# EAGLE design Argos_Battery_Charge_Monitor_Sensor (EAGLE 8.4.2)
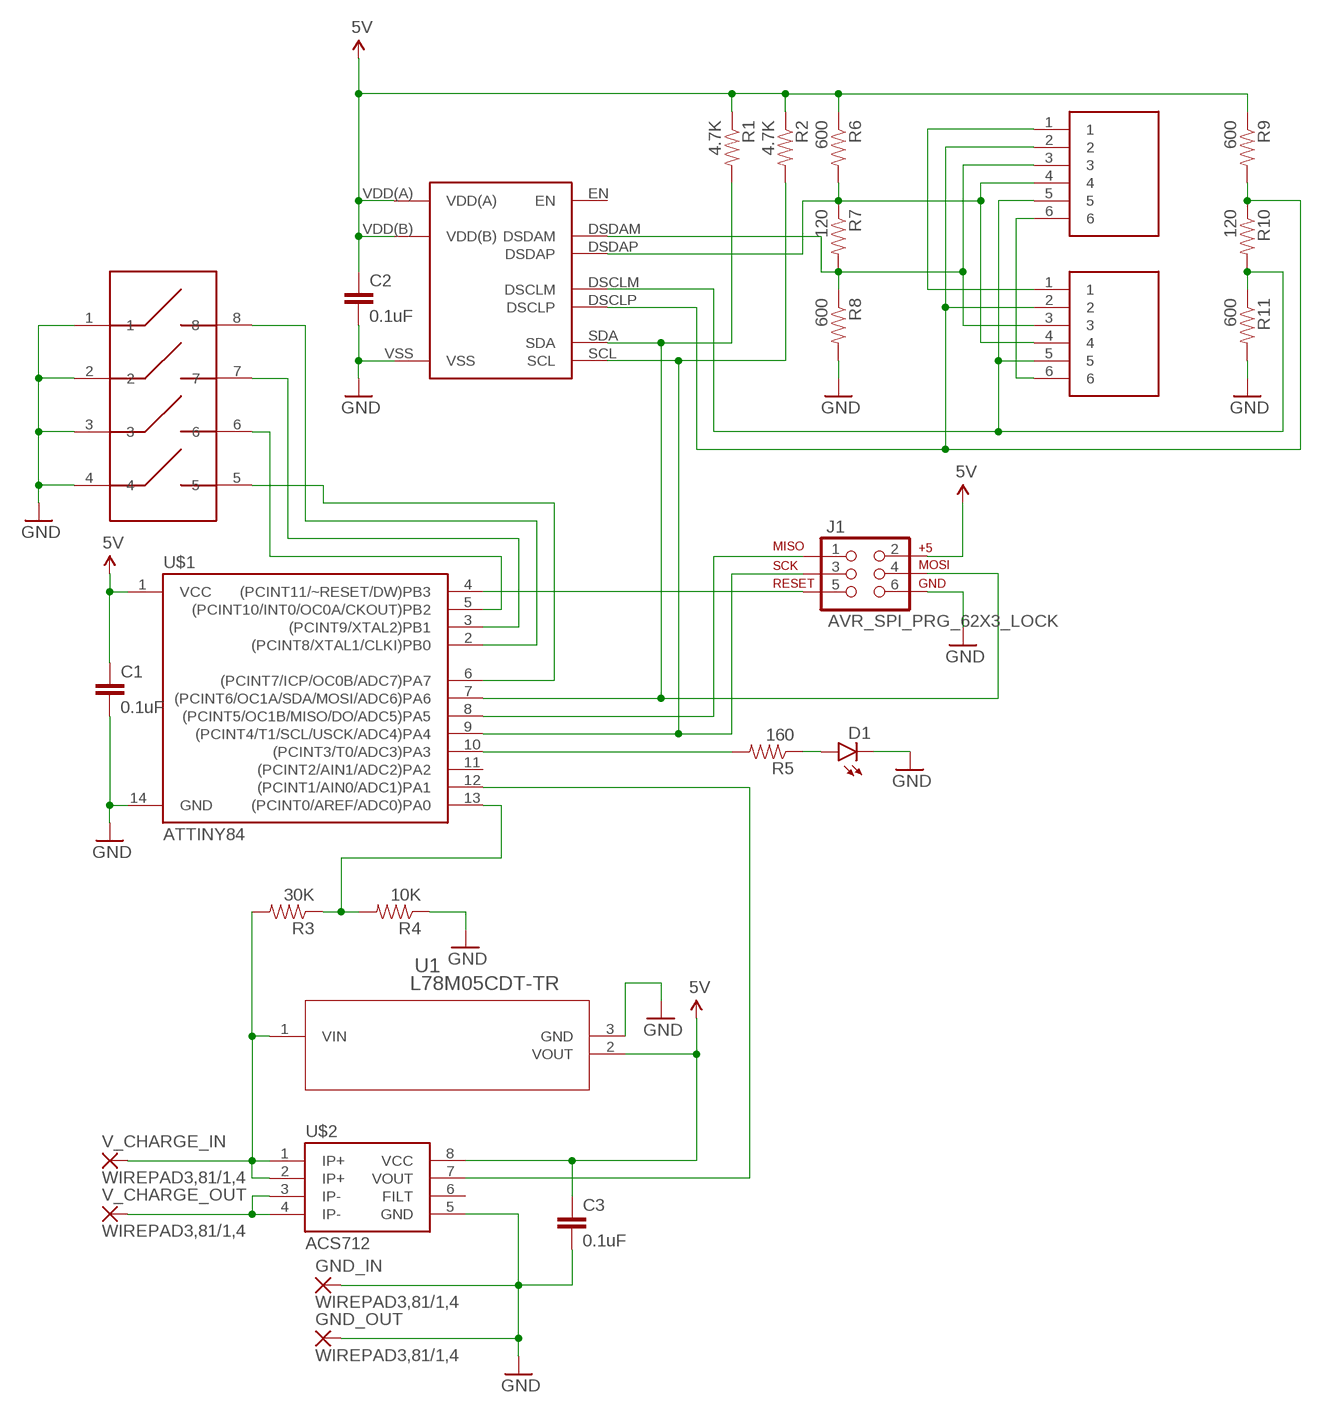
[diagram p0: schematic, sheet 1]

## Parts
C1  0.1uF  CAP0805  [0805]
C2  0.1uF  CAP0805  [0805]
C3  0.1uF  CAP0805  [0805]
D1  LED3MM  [LED3MM]
GND_IN  WIREPAD3,81/1,4  [3,81/1,4]
GND_OUT  WIREPAD3,81/1,4  [3,81/1,4]
J1  AVR_SPI_PRG_62X3_LOCK  [2X3_LOCK]
R1  4.7K  RESISTOR0805-RES  [0805]
R2  4.7K  RESISTOR0805-RES  [0805]
R3  30K  RESISTOR0805-RES  [0805]
R4  10K  RESISTOR0805-RES  [0805]
R5  160  RESISTOR0805-RES  [0805]
R6  600  RESISTOR0805-RES  [0805]
R7  120  RESISTOR0805-RES  [0805]
R8  600  RESISTOR0805-RES  [0805]
R9  600  RESISTOR0805-RES  [0805]
R10  120  RESISTOR0805-RES  [0805]
R11  600  RESISTOR0805-RES  [0805]
U1  L78M05CDT-TR  [DPAK]
U$1  ATTINY84  [SO14]
U$2  ACS712  [SO08]
U$3  SOP50P490X110-10N  [SOP50P490X110-10N]
U$4  E5566-Q0LK22-L  [E5566-Q0LK22-L]
U$5  E5566-Q0LK22-L  [E5566-Q0LK22-L]
U$6  210-4MS  [210-4MS]
V_CHARGE_IN  WIREPAD3,81/1,4  [3,81/1,4]
V_CHARGE_OUT  WIREPAD3,81/1,4  [3,81/1,4]

## Nets
5V: C1.1 C2.1 C3.1 J1.2 R1.1 R2.1 R6.1 R9.1 U1.2(VOUT) U$1.1(VCC) U$2.8(VCC) U$3.VDD(A) U$3.VDD(B)
D_SCK_M: R10.2 R11.1 U$3.DSCLM U$4.5 U$5.5
D_SCK_P: R9.2 R10.1 U$3.DSCLP U$4.2 U$5.2
D_SDA_M: R7.2 R8.1 U$3.DSDAM U$4.3 U$5.3
D_SDA_P: R6.2 R7.1 U$3.DSDAP U$4.4 U$5.4
GND: C1.2 C2.2 C3.2 D1.K(C) GND_IN.1(P) GND_OUT.1(P) J1.6 R4.1 R8.2 R11.2 U1.3(GND) U$1.14(GND) U$2.5(GND) U$3.VSS U$6.1 U$6.2 U$6.3 U$6.4
N$1: U$4.1 U$5.1
N$2: U$1.5((PCINT10/INT0/OC0A/CKOUT)PB2) U$6.6
N$3: U$1.3((PCINT9/XTAL2)PB1) U$6.7
N$4: U$1.2((PCINT8/XTAL1/CLKI)PB0) U$6.8
N$5: U$1.6((PCINT7/ICP/OC0B/ADC7)PA7) U$6.5
N$6: U$4.6 U$5.6
N$7 [POWER]: R3.2 U1.1(VIN) U$2.1(IP+) U$2.2(IP+) V_CHARGE_IN.1(P)
N$8: R3.1 R4.2 U$1.13((PCINT0/AREF/ADC0)PA0)
N$9 [POWER]: U$2.3(IP-) U$2.4(IP-) V_CHARGE_OUT.1(P)
N$11: U$1.12((PCINT1/AIN0/ADC1)PA1) U$2.7(VOUT)
N$12: D1.A R5.1
N$13: J1.5 U$1.4((PCINT11/~RESET/DW)PB3)
N$15: J1.1 U$1.8((PCINT5/OC1B/MISO/DO/ADC5)PA5)
N$16: R5.2 U$1.10((PCINT3/T0/ADC3)PA3)
SCL: J1.3 R2.2 U$1.9((PCINT4/T1/SCL/USCK/ADC4)PA4) U$3.SCL
SDA: J1.4 R1.2 U$1.7((PCINT6/OC1A/SDA/MOSI/ADC6)PA6) U$3.SDA
Unconnected: U$1.11((PCINT2/AIN1/ADC2)PA2) U$2.6(FILT) U$3.EN

## Library data of the parts
C1-C3 = SparkFun-Capacitors:CAP: Capacitor Standard 0603 ceramic capacitor, and 0.1" leaded capacitor.
D1 = SparkFun-LED:LED: LEDs Standard schematic elements and footprints for 5mm, 3mm, 1206, and 0603 sized LEDs. 5mm - Spark Fun Electronics SKU : COM-00529 (and others); PROD_ID: DIO-08794
GND_IN GND_OUT V_CHARGE_IN V_CHARGE_OUT = wirepad:WIREPAD: Wire PAD connect wire on PCB
J1 = SparkFun-Connectors:AVR_SPI_PRG_6: AVR ISP 6 Pin This is the reduced ISP connector for AVR programming. Common on Arduino. This footprint will take up less PCB space and can be used with a 10-pin to 6-pin adapter such as SKU: BOB-08508 **Special note about "TEST_POINT" package. The stop mask is on the top side, so if you want your programming test points to be on the bottom of your board, make sure to place this package on the bottom side of the board. This also ensure that the orientation to program from the bottom side will be correct.
R1-R11 = SparkFun-Passives:RESISTOR: Resistor Basic schematic elements and footprints for 0603, 1206, and PTH resistors.
U1 = Digikey:L78M05CDT-TR; MANUFACTURER_PART_NUMBER: L78M05CDTTR; VENDOR: ST Microelectronics
U$1 = SparkFun-DigitalIC:ATTINY84: Atmel 14-pin 2/4/8kB flash uC; PROD_ID: IC-11285
U$2 = SparkFun-AnalogIC:ACS712: Hall-effect-based isolated linear current sensor; PROD_ID: IC-08964
U$3 = SOP50P490X110-10N:SOP50P490X110-10N
U$4 U$5 = E5566-Q0LK22-L:E5566-Q0LK22-L
U$6 = 210-4MS:210-4MS

## Net classes
0 default: width 0.152 mm, clearance 0.152 mm
1 POWER: width 3.607 mm, clearance 0.152 mm

## Board
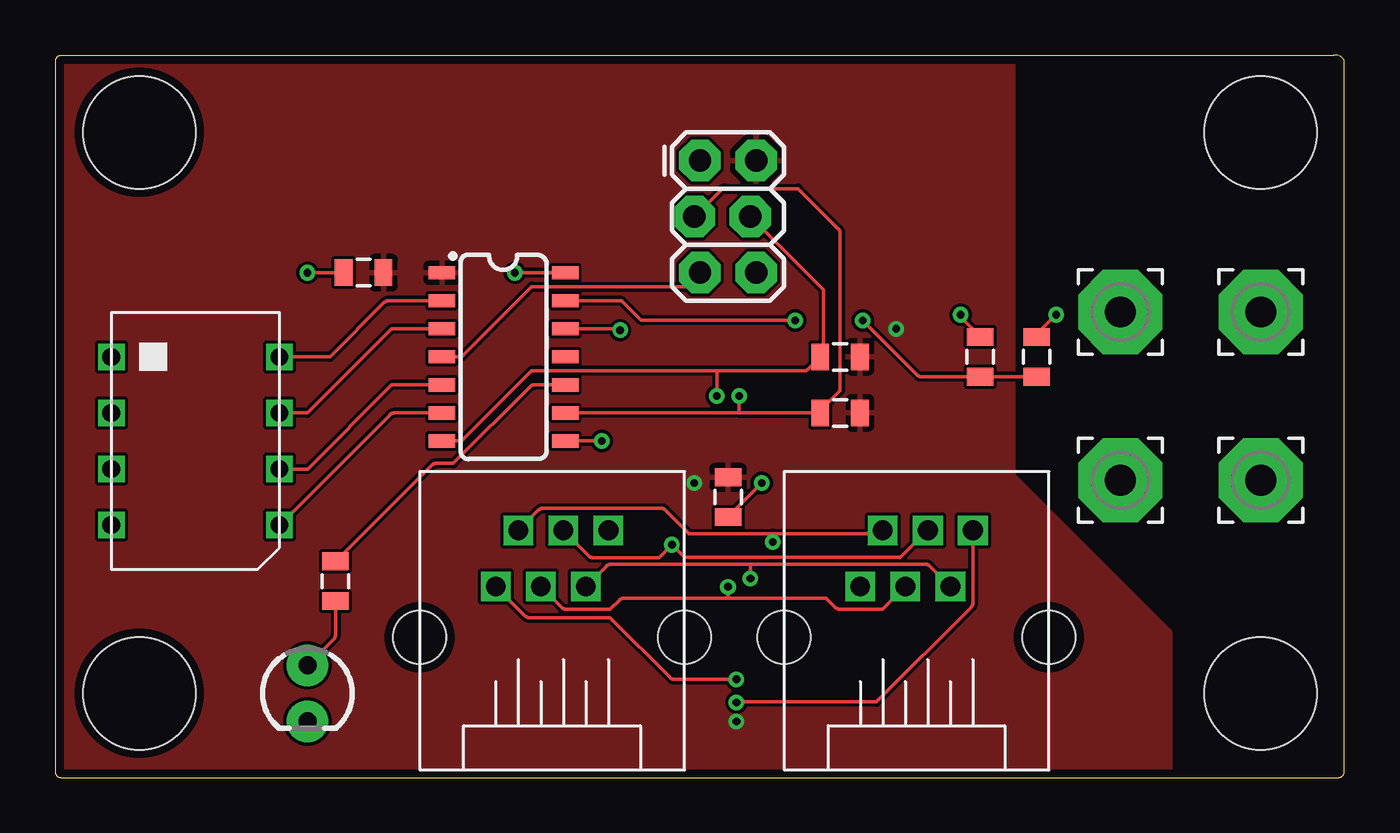
[diagram p1: board, top side]
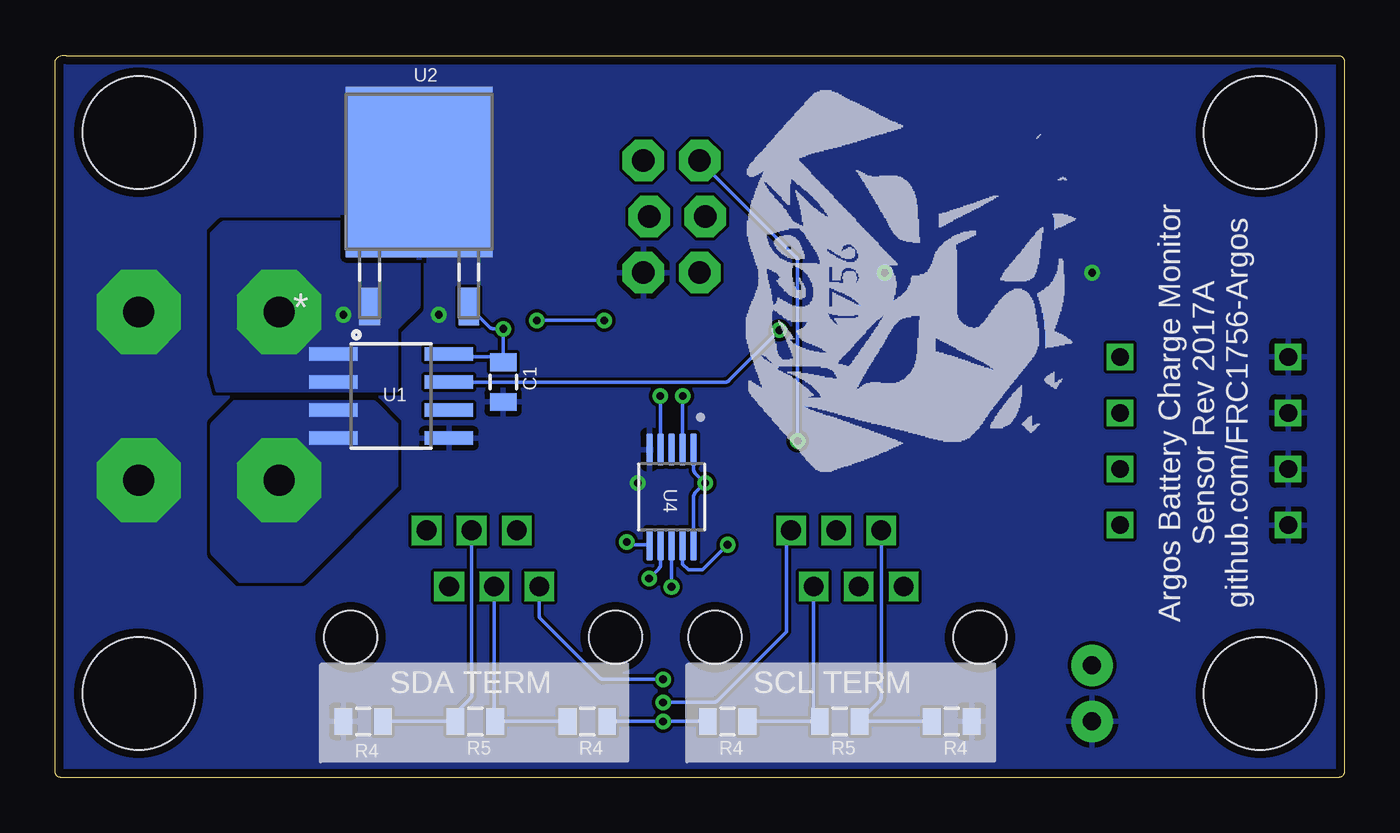
[diagram p2: board, bottom side, seen from below]

Size 58.4 x 32.71 mm. Coordinates in mm from the lower left corner, seen from the top.
Outline: 0,32.44 0,0.25 arc90 0.25,0 58.15,0 arc90 58.4,0.25 58.4,32.44 arc90 57.89,32.69 0.25,32.69 arc90 0,32.44
Copper layers (1*16): Top 0.0356mm / dielectric 1.5011mm / Bottom 0.0356mm
Design rules "LaenPCBOrder": minimum track width 6mil, minimum drill 13mil, track to track 6mil, track to pad 6mil, pad to pad 6mil, via to via 6mil, smd to smd 6mil, copper to edge 15mil, drill to drill 6mil, minimum pad ring 7mil, minimum via ring 7mil, stop-mask expansion 3mil, vias tented up to drill 0mil, thermal gap 10mil
Holes 5.08 mm at 3.81,3.81 54.61,3.81 3.81,29.21 54.61,29.21

### Footprints (pad centres in the part's own frame; a part is rotated, then mirrored left to right if it is on the bottom)
0805 = smd 0.8 x 1.2: 1 -0.9,0; 2 0.9,0
LED3MM = drill 0.813 pad 1.88: A -1.27,0; K 1.27,0
3,81/1,4 = drill 1.397 pad 3.81 octagon: 1 0,0
2X3_LOCK = drill 1.016 pad 1.88 octagon: 1 0,0; 2 0,2.54; 3 2.54,-0.254; 4 2.54,2.286; 5 5.08,0; 6 5.08,2.54
DPAK = smd 0.94 x 1.702: 1 -2.25,-6.109; 2 2.25,-6.109 | smd 6.655 x 7.722: 3 0,0
SO14 = smd 0.6 x 1.2: 1 -3.81,-2.8; 2 -2.54,-2.8; 3 -1.27,-2.8; 4 0,-2.8; 5 1.27,-2.8; 6 2.54,-2.8; 7 3.81,-2.8; 8 3.81,2.8; 9 2.54,2.8; 10 1.27,2.8; 11 0,2.8; 12 -1.27,2.8; 13 -2.54,2.8; 14 -3.81,2.8
SO08 = smd 0.61 x 2.21: 1 -1.905,-2.616; 2 -0.635,-2.616; 3 0.635,-2.616; 4 1.905,-2.616; 5 1.905,2.616; 6 0.635,2.616; 7 -0.635,2.616; 8 -1.905,2.616
SOP50P490X110-10N = smd 1.47 x 0.31: DSCLM 2.15,-1; DSCLP 2.15,-0.5; DSDAM 2.15,0.5; DSDAP 2.15,0; EN -2.15,0; SCL -2.15,-0.5; SDA -2.15,0.5; VDD(A) -2.15,1; VDD(B) 2.15,1; VSS -2.15,-1
E5566-Q0LK22-L = drill 0.9 square: 1 8.55,4.84; 2 7.53,2.3; 3 6.51,4.84; 4 5.49,2.3; 5 4.47,4.84; 6 3.45,2.3 | hole 2.4: 0,0; 12,0
210-4MS = drill 0.8 square: 1 0,7.62; 2 0,5.08; 3 0,2.54; 4 0,0; 5 7.62,0; 6 7.62,2.54; 7 7.62,5.08; 8 7.62,7.62

### Placement (x,y rotation side)
C1  13.97,22.86 180 top
C2  30.48,12.7 270 top
C3  38.1,17.91 270 bottom
D1  11.43,3.81 270 top
GND_IN  54.61,21.08 0 top
GND_OUT  54.61,13.46 0 top
J1  29.21,27.94 270 top
R1  35.56,19.05 180 top
R2  35.56,16.51 180 top
R3  44.45,19.05 90 top
R4  41.91,19.05 270 top
R5  12.7,8.89 90 top
R6  34.29,2.54 180 bottom
R7  39.37,2.54 180 bottom
R8  44.45,2.54 180 bottom
R9  27.94,2.54 0 bottom
R10  22.86,2.54 0 bottom
R11  17.78,2.54 0 bottom
U1  41.91,27.43 0 bottom
U$1  20.32,19.05 270 top
U$2  43.18,17.27 270 bottom
U$3  30.48,12.7 270 bottom
U$4  33.02,6.35 0 top
U$5  16.51,6.35 0 top
U$6  2.54,11.43 0 top
V_CHARGE_IN  48.26,21.08 0 top
V_CHARGE_OUT  48.26,13.46 0 top

### Tracks (layer width: path | path; a pad name or v marks a point on that pad's centre or on a via)
5V  (via drill 0.35)
  Bottom 0.152: R9.1 v30.86,2.54 R6.1 | 38.1,19.05 v38.1,20.32 38.55,20.32 arc45 38.73,20.39 U1.2 | 38.1,19.05 C3.1 | U$2.8 40.51,19.12 arc-45 40.33,19.05 38.1,19.05 | U$3.VDD(A) 29.48,13.96 arc-45 29.41,13.79 v28.96,13.34 29.41,12.88 arc-45 29.48,12.71 U$3.VDD(B)
  pour Top: 0,32.77 0,0 50.55,0 50.55,6.5 arc45 50.47,6.68 43.43,13.72 43.43,32.77
D_SCK_M  (via drill 0.35)
  Top 0.152: U$5.5 21.91,12.12 arc-45 22.09,12.19 27.45,12.19 arc-45 27.63,12.12 28.7,11.05 32.51,11.05 | 32.51,11.05 37.24,11.05 arc45 37.42,11.12 U$4.5 | 32.51,11.05 v32.51,10.67
  Bottom 0.152: R11.1 R10.2 21.05,3.45 arc-45 20.98,3.62 U$5.5 | U$3.DSCLM 32.49,10.55 arc-45 v32.51,10.67
D_SCK_P  (via drill 0.35)
  Top 0.152: U$5.2 24.97,9.58 arc-45 25.15,9.65 31.5,9.65 | 31.5,9.65 v31.5,9.02 | 31.5,9.65 39.44,9.65 arc-45 39.62,9.58 U$4.2
  Bottom 0.152: R9.2 R10.1 23.97,2.75 arc45 24.04,2.92 U$5.2 | U$3.DSCLP 30.98,9.64 arc45 31.05,9.46 v31.5,9.02
D_SDA_M  (via drill 0.35)
  Top 0.152: U$4.3 arc45 39.5,11.18 38.29,9.97 | 38.29,9.97 38.28,9.96 | 38.29,9.97 28.62,9.97 arc-45 28.44,10.04 v27.94,10.54 27.36,9.96 24.36,9.96 arc-45 24.18,10.03 U$5.3
  Bottom 0.152: R8.1 R7.2 40.27,2.81 arc45 40.2,2.98 39.6,3.58 arc-45 39.53,3.75 U$4.3 | v27.94,10.54 29.08,9.4 29.72,9.4 29.97,9.65 29.97,10.53 arc-45 U$3.DSDAM
D_SDA_P  (via drill 0.35)
  Top 0.152: U$5.4 22.96,7.69 arc45 23.13,7.62 25.15,7.62 25.58,8.05 arc-45 25.76,8.13 30.48,8.13 | 30.48,8.13 34.92,8.13 35.36,7.69 arc45 35.54,7.62 37.47,7.62 38.48,8.64 arc-45 U$4.4 | v30.48,8.64 30.48,8.13
  Bottom 0.152: R6.2 R7.1 arc45 38.51,2.64 U$4.4 | v30.48,8.64 U$3.DSDAP
GND  (via drill 0.35)
  Top 0.152: v11.43,22.86 C1.2 | U$1.14 v20.83,22.86 | R4.1 41.09,20.77 arc-45 v41.02,20.94 v41.02,20.95 | v32,13.34 30.49,11.82 arc45 C2.2
  pour Bottom (rank 2): 0,32.77 0,0 58.42,0 58.42,32.77
  pour Bottom (isolate 0.254, rank 2, no thermals): 37.59,32.77 37.59,22.86 44.7,22.86 44.45,8.23 arc45 44.52,8.05 52.5,0.07 arc45 52.68,0 58.42,0 58.42,32.77
N$1  (via drill 0.35)
  Top 0.152: U$4.1 41.57,7.89 arc-45 41.5,7.71 37.21,3.43 30.94,3.43 arc45 v30.86,3.4
  Bottom 0.152: v30.86,3.4 28.58,3.4 arc-45 28.4,3.47 25.27,6.6 25.27,10.87 arc45 25.2,11.05 U$5.1
N$2
  Top 0.152: U$1.5 15.24,17.78 11.43,13.97 U$6.6
N$3
  Top 0.152: U$1.3 15.24,20.32 11.43,16.51 U$6.7
N$4
  Top 0.152: U$6.8 12.45,19.05 14.91,21.52 arc-45 15.09,21.59 U$1.2
N$5
  Top 0.152: U$1.6 15.35,16.51 arc45 15.17,16.44 U$6.5
N$6  (via drill 0.35)
  Top 0.152: U$5.6 21.3,7.31 arc45 21.48,7.24 25.15,7.24 27.87,4.52 arc45 28.04,4.45 v30.86,4.45
  Bottom 0.152: v30.86,4.45 33.55,4.45 arc45 33.73,4.52 36.45,7.24 arc45 36.47,7.29 U$4.6
N$7  (via drill 0.35)
  Top 0.152: R3.2 R3.2 arc-45 44.52,20.14 v45.34,20.95
  pour Bottom (isolate 0.254, no thermals): 41.91,24.64 41.91,21.44 arc45 41.98,21.26 42.93,20.32 42.93,17.53 51.05,17.53 51.23,18.21 arc45 51.31,18.39 51.31,24.64 50.87,25.07 arc45 50.69,25.15 42.42,25.15
N$8  (via drill 0.35)
  Top 0.152: R3.1 R4.2 39.23,18.15 arc-45 39.05,18.22 v36.58,20.7 | v33.53,20.7 26.65,20.7 arc-45 26.47,20.77 25.65,21.59 U$1.13
  Bottom 0.152: v36.58,20.7 v33.53,20.7
N$9
  pour Bottom (isolate 0.254, no thermals): 42.93,13.21 47.17,8.96 arc45 47.35,8.89 50.04,8.89 51.23,10.09 arc45 51.31,10.27 51.31,15.9 arc45 51.23,16.08 50.29,17.02 44.05,17.02 arc45 43.87,16.94 42.93,16
N$11  (via drill 0.35)
  Top 0.152: U$1.12 25.44,20.32 arc-45 v25.59,20.26
  Bottom 0.152: U$2.7 28.04,17.91 arc-45 27.87,17.98 v25.59,20.26 | v25.59,20.26 25.53,20.32 v25.59,20.26
N$12
  Top 0.152: R5.1 12.7,6.46 arc-45 12.63,6.28 D1.A
N$13
  Top 0.152: U$1.4 18.31,19.05 arc45 18.49,19.12 21.59,22.23 28.47,22.23 arc45 28.65,22.3 J1.5
N$15  (via drill 0.35)
  Top 0.152: U$1.8 v24.76,15.24
  Bottom 0.152: v24.76,15.24 24.76,23.39 arc-45 24.84,23.57 J1.1
N$16
  Top 0.152: U$1.10 21.7,17.78 arc45 21.52,17.71 18.03,14.22 17.24,14.22 arc45 17.06,14.15 R5.2
SCL  (via drill 0.35)
  Top 0.152: J1.3 30.15,26.6 arc-45 30.33,26.67 33.66,26.67 35.49,24.84 arc-45 35.56,24.66 35.56,17.53 34.73,16.7 arc45 34.66,16.52 R2.2 30.99,16.51 | 30.99,16.51 U$1.9 | v30.99,17.27 30.99,16.51
  Bottom 0.152: v30.99,17.27 30.99,14.87 arc-45 U$3.SCL
SDA  (via drill 0.35)
  Top 0.152: J1.4 34.8,22.1 34.8,19.29 arc-45 34.72,19.11 R1.2 34.1,18.49 arc-45 33.92,18.41 29.97,18.41 | 29.97,18.41 21.59,18.41 18.49,15.31 arc-45 18.31,15.24 U$1.7 | 29.97,18.41 v29.97,17.27
  Bottom 0.152: v29.97,17.27 29.97,14.87 arc45 U$3.SDA

### Text on the board
_tsilk: ICSP | MISO | 5V | SCK | MOSI | CHARGER IN | + | - | I2C Addr | RST | GND | C1 | R2 | 8 | U3 | R1 | R3 | 4 | R3 | 2 | C1 | 1 | + | - | R6 | CHARGER OUT | STATUS
_bsilk: U2 | C1 | Argos Battery Charge Monitor / Sensor Rev 2017A / github.com/FRC1756-Argos | U1 | U4 | SCL TERM | SDA TERM | R4 | R5 | R4 | R4 | R5 | R4